# Altium project DaughterBoard Tester.PrjPcb
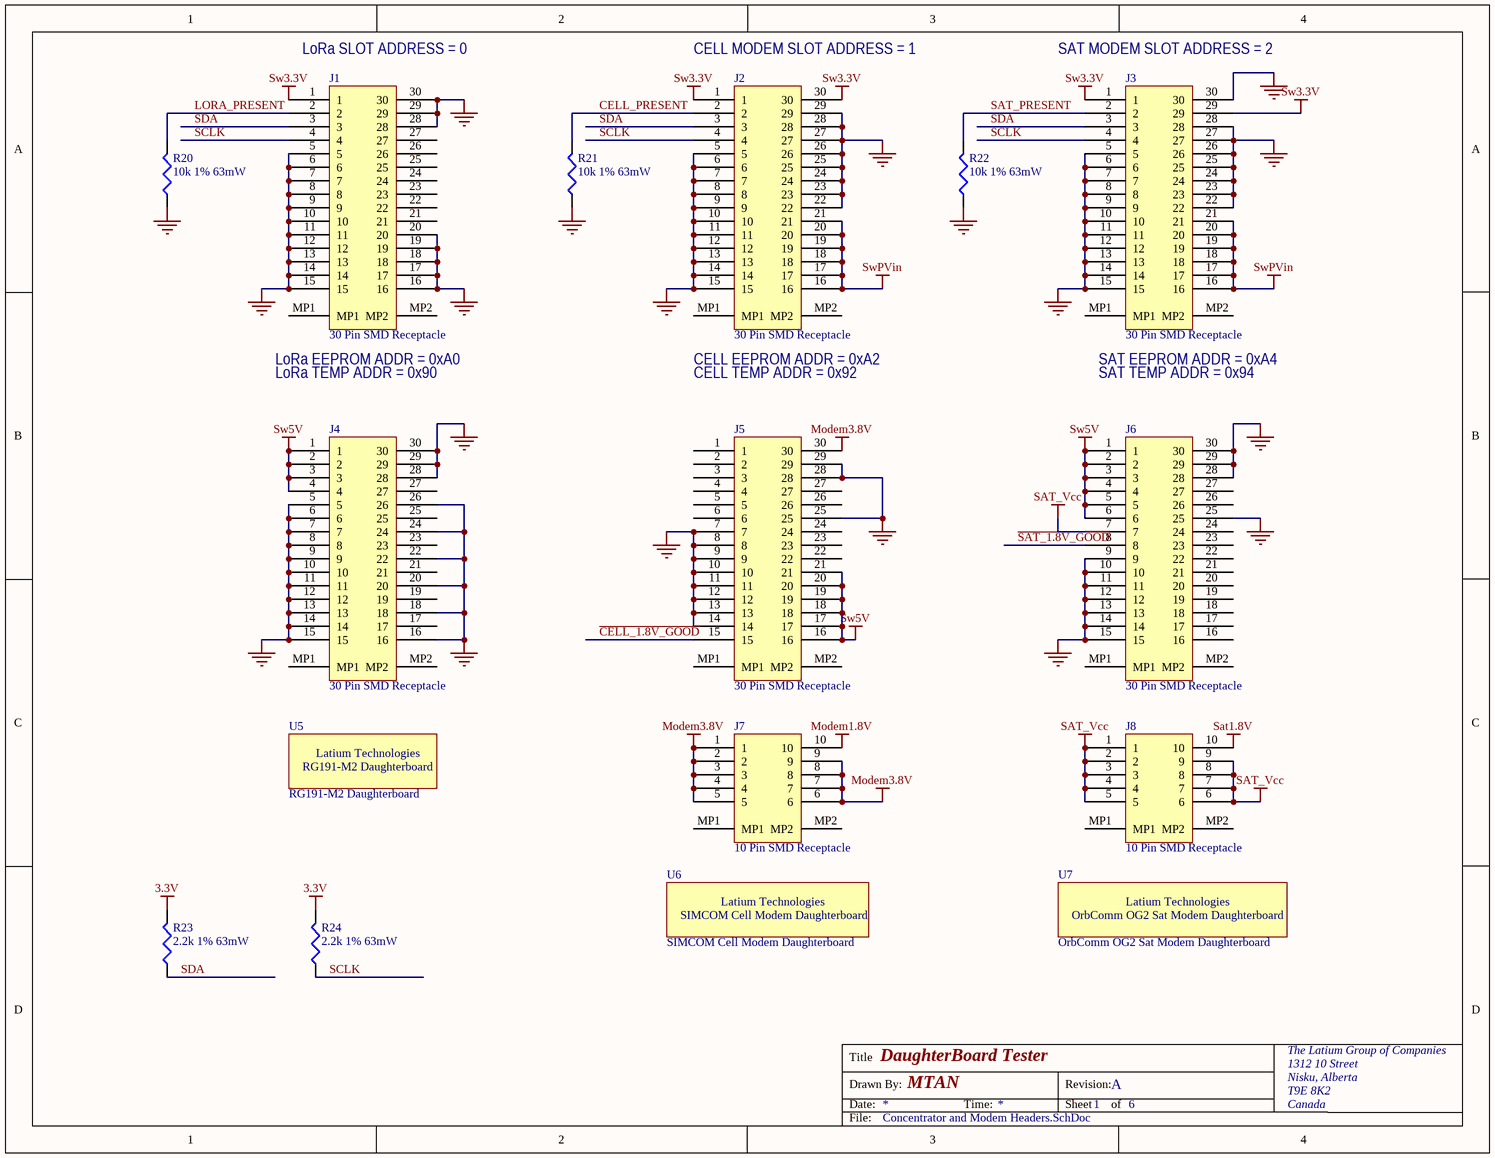
[diagram p0: Concentrator and Modem Headers.SchDoc]
6 sheets, 158 parts. Net scope: global (net labels, ports and power ports of the same name join across sheets).
Board file: DaughterBoard Tester.PcbDoc
Sheets:
  Concentrator and Modem Headers.SchDoc
  Expansion Headers.SchDoc
  USB.SchDoc
  Analog.SchDoc
  Power Supplies.SchDoc
  Loads.SchDoc

## Sheet Concentrator and Modem Headers.SchDoc: DaughterBoard Tester
size Letter; DrawnBy: MTAN; Organization: Altium Limited; DocumentNumber: 1; Revision: A; SheetNumber: 1; SheetTotal: 6

### Parts
J1  30 Pin SMD Receptacle  [10132798-031100LF]
J2  30 Pin SMD Receptacle  [10132798-031100LF]
J3  30 Pin SMD Receptacle  [10132798-031100LF]
J4  30 Pin SMD Receptacle  [10132798-031100LF]
J5  30 Pin SMD Receptacle  [10132798-031100LF]
J6  30 Pin SMD Receptacle  [10132798-031100LF]
J7  10 Pin SMD Receptacle  [10132798-011100LF]
J8  10 Pin SMD Receptacle  [10132798-011100LF]
R20  10k 1% 63mW  [RESC1005L]
R21  10k 1% 63mW  [RESC1005L]
R22  10k 1% 63mW  [RESC1005L]
R23  2.2k 1% 63mW  [RESC1005L]
R24  2.2k 1% 63mW  [RESC1005L]
U5  RG191-M2 Daughterboard  [RG191-M2 LoRa Daughterboard]  (no BOM)
U6  SIMCOM Cell Modem Daughterboard  [SIMCOM Cell Modem Daughterboard]  (no BOM)
U7  OrbComm OG2 Sat Modem Daughterboard  [OrbComm OG2 Daughterboard]  (no BOM)

### Nets
3.3V: R23.2 R24.2
GND: J1.5 J1.6 J1.7 J1.8 J1.9 J1.10 J1.11 J1.12 J1.13 J1.14 J1.15 J1.16 J1.17 J1.18 J1.19 J1.20 J1.28 J1.29 J1.30 J2.5 J2.6 J2.7 J2.8 J2.9 J2.10 J2.11 J2.12 J2.13 J2.14 J2.15 J2.22 J2.23 J2.24 J2.25 J2.26 J2.27 J2.28 J2.29 J3.5 J3.6 J3.7 J3.8 J3.9 J3.10 J3.11 J3.12 J3.13 J3.14 J3.15 J3.22 J3.23 J3.24 J3.25 J3.26 J3.27 J3.28 J3.30 J4.5 J4.6 J4.7 J4.8 J4.9 J4.10 J4.11 J4.12 J4.13 J4.14 J4.15 J4.16 J4.18 J4.20 J4.22 J4.24 J4.26 J4.28 J4.29 J4.30 J5.7 J5.8 J5.9 J5.10 J5.11 J5.12 J5.13 J5.14 J5.25 J5.28 J5.29 J6.9 J6.10 J6.11 J6.12 J6.13 J6.14 J6.15 J6.25 J6.28 J6.29 J6.30 R20.1 R21.1 R22.1
Modem1.8V: J7.10
Modem3.8V: J5.30 J7.1 J7.2 J7.3 J7.4 J7.5 J7.6 J7.7 J7.8 J7.9
Sat1.8V: J8.10
SAT_Vcc: J6.7 J8.1 J8.2 J8.3 J8.4 J8.5 J8.6 J8.7 J8.8 J8.9
Sw3.3V: J1.1 J2.1 J2.30 J3.1 J3.29
Sw5V: J4.1 J4.2 J4.3 J4.4 J5.16 J5.17 J5.18 J5.19 J5.20 J5.21 J6.1 J6.2 J6.3 J6.4 J6.5 J6.6
SwPVin: J2.16 J2.17 J2.18 J2.19 J2.20 J2.21 J3.16 J3.17 J3.18 J3.19 J3.20 J3.21
~{CELL_1.8V_GOOD}: J5.15
CELL_PRESENT: J2.2 R21.2
LORA_PRESENT: J1.2 R20.2
~{SAT_1.8V_GOOD}: J6.8
SAT_PRESENT: J3.2 R22.2
SCLK: J1.4 J2.4 J3.4 R24.1
SDA: J1.3 J2.3 J3.3 R23.1

Not connected (* = marked no-connect by the designer): J1 21 22 23 24 25 26 27 MP1 MP2; J2 MP1 MP2; J3 MP1 MP2; J4 17 19 21 23 25 27 MP1 MP2; J5 1 2 3 4 5 6 22 23 24 26 27 MP1 MP2; J6 16 17 18 19 20 21 22 23 24 26 27 MP1 MP2; J7 MP1 MP2; J8 MP1 MP2

### Notes on the sheet
- (near J1) LoRa SLOT ADDRESS = 0
- (near J2) CELL MODEM SLOT ADDRESS = 1
- (near J3) SAT MODEM SLOT ADDRESS = 2
- (near J1) LoRa EEPROM ADDR = 0xA0
- (near J2) CELL EEPROM ADDR = 0xA2
- (near J3) SAT EEPROM ADDR = 0xA4
- LoRa TEMP ADDR = 0x90
- CELL TEMP ADDR = 0x92
- SAT TEMP ADDR = 0x94
- Title
- Drawn By:
- Date:
- Time:
- Revision:
- Sheet
- of
- The Latium Group of Companies
- 1312 10 Street
- Nisku, Alberta
- T9E 8K2
- Canada
- File:
- (in symbol OrbComm OG2 Sat Modem Daughterboard) Latium Technologies
- (in symbol RG191-M2 Daughterboard) Latium Technologies
- (in symbol SIMCOM Cell Modem Daughterboard) Latium Technologies

### Library data of the parts
J1-J6 = Amphenol 30 Pos BergStak Plug: CONN RCPT 30POS SMD GOLD; Manufacturer: Amphenol ICC (FCI); Note: Mates with 10132797-031100LF plug 3mm between board height; Value: 30 Pin SMD Receptacle; Manufacturer Part Number: 10132798-031100LF; Supplier 1: Digi-Key; Supplier 1 Part Number: 609-5030-1-ND
J7 J8 = Amphenol 10 Pos BergStak Plug: CONN RCPT 10POS SMD GOLD; Manufacturer: Amphenol ICC (FCI); Note: Mates with 10132797-011100LF plug 3mm between board height; Value: 10 Pin SMD Receptacle; Manufacturer Part Number: 10132798-011100LF; Supplier 1: Digi-Key; Supplier 1 Part Number: 609-5026-1-ND
R20-R24 = Res3: Resistor
  R20-R22: Value: 10k 1% 63mW
  R23 R24: Value: 2.2k 1% 63mW
U5 = RG191-M2 Daughterboard: Value: RG191-M2 Daughterboard
U6 = SIMCOM Cell Modem Daughterboard: Value: SIMCOM Cell Modem Daughterboard
U7 = OrbComm OG2 Sat Modem Daughterboard: Value: OrbComm OG2 Sat Modem Daughterboard

## Sheet Expansion Headers.SchDoc: DaughterBoard Tester
size Letter; DrawnBy: MTAN; Organization: Altium Limited; DocumentNumber: 2; Revision: A; SheetNumber: 2; SheetTotal: 6
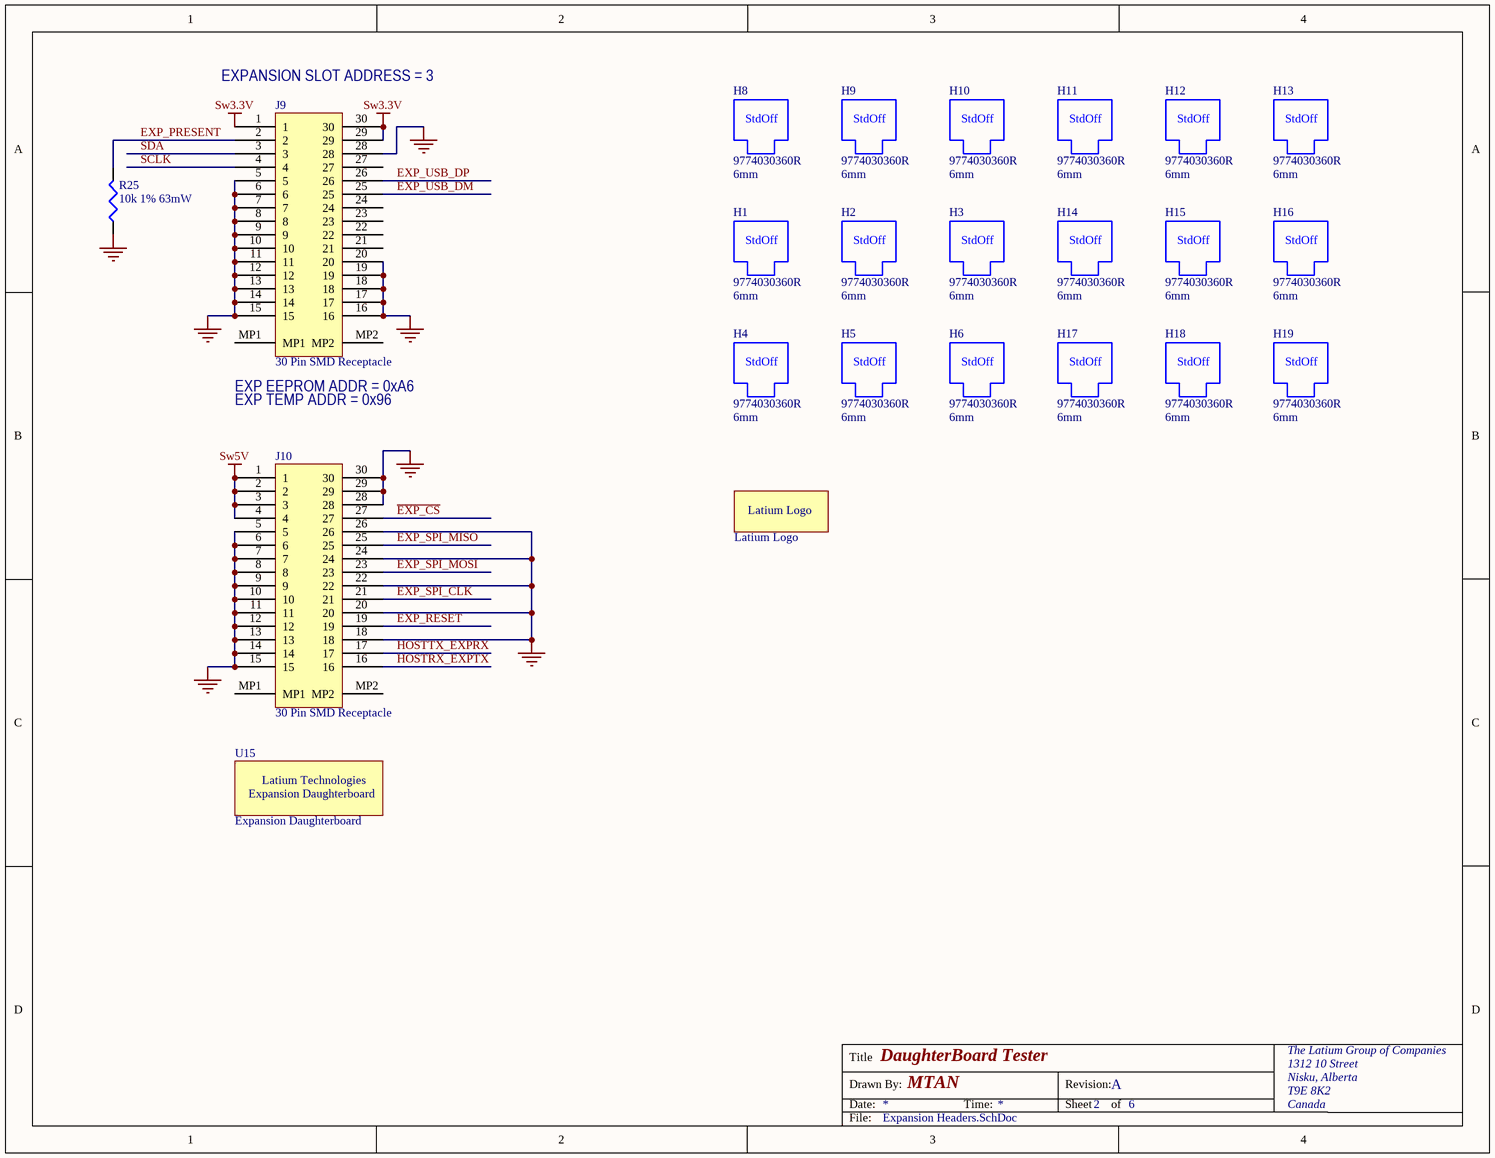
[diagram p1: Expansion Headers.SchDoc]

### Parts
H1  9774030360R  Height: 6mm  [Wurth 9774060360R]
H2  9774030360R  Height: 6mm  [Wurth 9774060360R]
H3  9774030360R  Height: 6mm  [Wurth 9774060360R]
H4  9774030360R  Height: 6mm  [Wurth 9774060360R]
H5  9774030360R  Height: 6mm  [Wurth 9774060360R]
H6  9774030360R  Height: 6mm  [Wurth 9774060360R]
H7  Latium Logo  [LatiumLogo]  (no BOM)
H8  9774030360R  Height: 6mm  [Wurth 9774060360R]
H9  9774030360R  Height: 6mm  [Wurth 9774060360R]
H10  9774030360R  Height: 6mm  [Wurth 9774060360R]
H11  9774030360R  Height: 6mm  [Wurth 9774060360R]
H12  9774030360R  Height: 6mm  [Wurth 9774060360R]
H13  9774030360R  Height: 6mm  [Wurth 9774060360R]
H14  9774030360R  Height: 6mm  [Wurth 9774060360R]
H15  9774030360R  Height: 6mm  [Wurth 9774060360R]
H16  9774030360R  Height: 6mm  [Wurth 9774060360R]
H17  9774030360R  Height: 6mm  [Wurth 9774060360R]
H18  9774030360R  Height: 6mm  [Wurth 9774060360R]
H19  9774030360R  Height: 6mm  [Wurth 9774060360R]
J9  30 Pin SMD Receptacle  [10132798-031100LF]
J10  30 Pin SMD Receptacle  [10132798-031100LF]
R25  10k 1% 63mW  [RESC1005L]
U15  Expansion Daughterboard  [Expansion Daughterboard]  (no BOM)

### Nets
GND: J9.5 J9.6 J9.7 J9.8 J9.9 J9.10 J9.11 J9.12 J9.13 J9.14 J9.15 J9.16 J9.17 J9.18 J9.19 J9.20 J9.28 J10.5 J10.6 J10.7 J10.8 J10.9 J10.10 J10.11 J10.12 J10.13 J10.14 J10.15 J10.18 J10.20 J10.22 J10.24 J10.26 J10.28 J10.29 J10.30 R25.1
Sw3.3V: J9.1 J9.29 J9.30
Sw5V: J10.1 J10.2 J10.3 J10.4
~{EXP_CS}: J10.27
EXP_PRESENT: J9.2 R25.2
EXP_RESET: J10.19
EXP_SPI_CLK: J10.21
EXP_SPI_MISO: J10.25
EXP_SPI_MOSI: J10.23
EXP_USB_DM: J9.25
EXP_USB_DP: J9.26
HOSTRX_EXPTX: J10.16
HOSTTX_EXPRX: J10.17
SCLK: J9.4
SDA: J9.3

Not connected (* = marked no-connect by the designer): J9 21 22 23 24 27 MP1 MP2; J10 MP1 MP2

### Notes on the sheet
- (near J9) EXPANSION SLOT ADDRESS = 3
- (near J9) EXP EEPROM ADDR = 0xA6
- EXP TEMP ADDR = 0x96
- Title
- Drawn By:
- Date:
- Time:
- Revision:
- Sheet
- of
- The Latium Group of Companies
- 1312 10 Street
- Nisku, Alberta
- T9E 8K2
- Canada
- File:
- (in symbol Expansion Daughterboard) Latium Technologies
- (in symbol SMD M3 Spacer) StdOff

### Library data of the parts
H1-H6 H8-H19 = SMD M3 Spacer: ROUND STANDOFF M3X0.5 STEEL 6MM; Manufacturer: Wurth Electronics Inc; Manufacturer Part Number: 9774060360R; Supplier 1: Digi-Key; Value: 9774030360R; ComponentLink1Description: Drawing; ComponentLink1URL: S:\Hardware\Data Sheets\Passive\Spacers\Wurth 9774060360R.pdf; Supplier 1 Part Number: 732-5273-1-ND
J9 J10 = Amphenol 30 Pos BergStak Plug: as J1 on sheet Concentrator and Modem Headers; Value: 30 Pin SMD Receptacle; Manufacturer Part Number: 10132798-031100LF; Supplier 1: Digi-Key; Supplier 1 Part Number: 609-5030-1-ND
R25 = Res3: Resistor; Value: 10k 1% 63mW
H7 = Latium Logo: Value: Latium Logo
U15 = Expansion Daughterboard: Value: Expansion Daughterboard

## Sheet USB.SchDoc: DaughterBoard Tester
size Letter; DrawnBy: MTAN; Organization: Altium Limited; DocumentNumber: 3; Revision: A; SheetNumber: 3; SheetTotal: 6
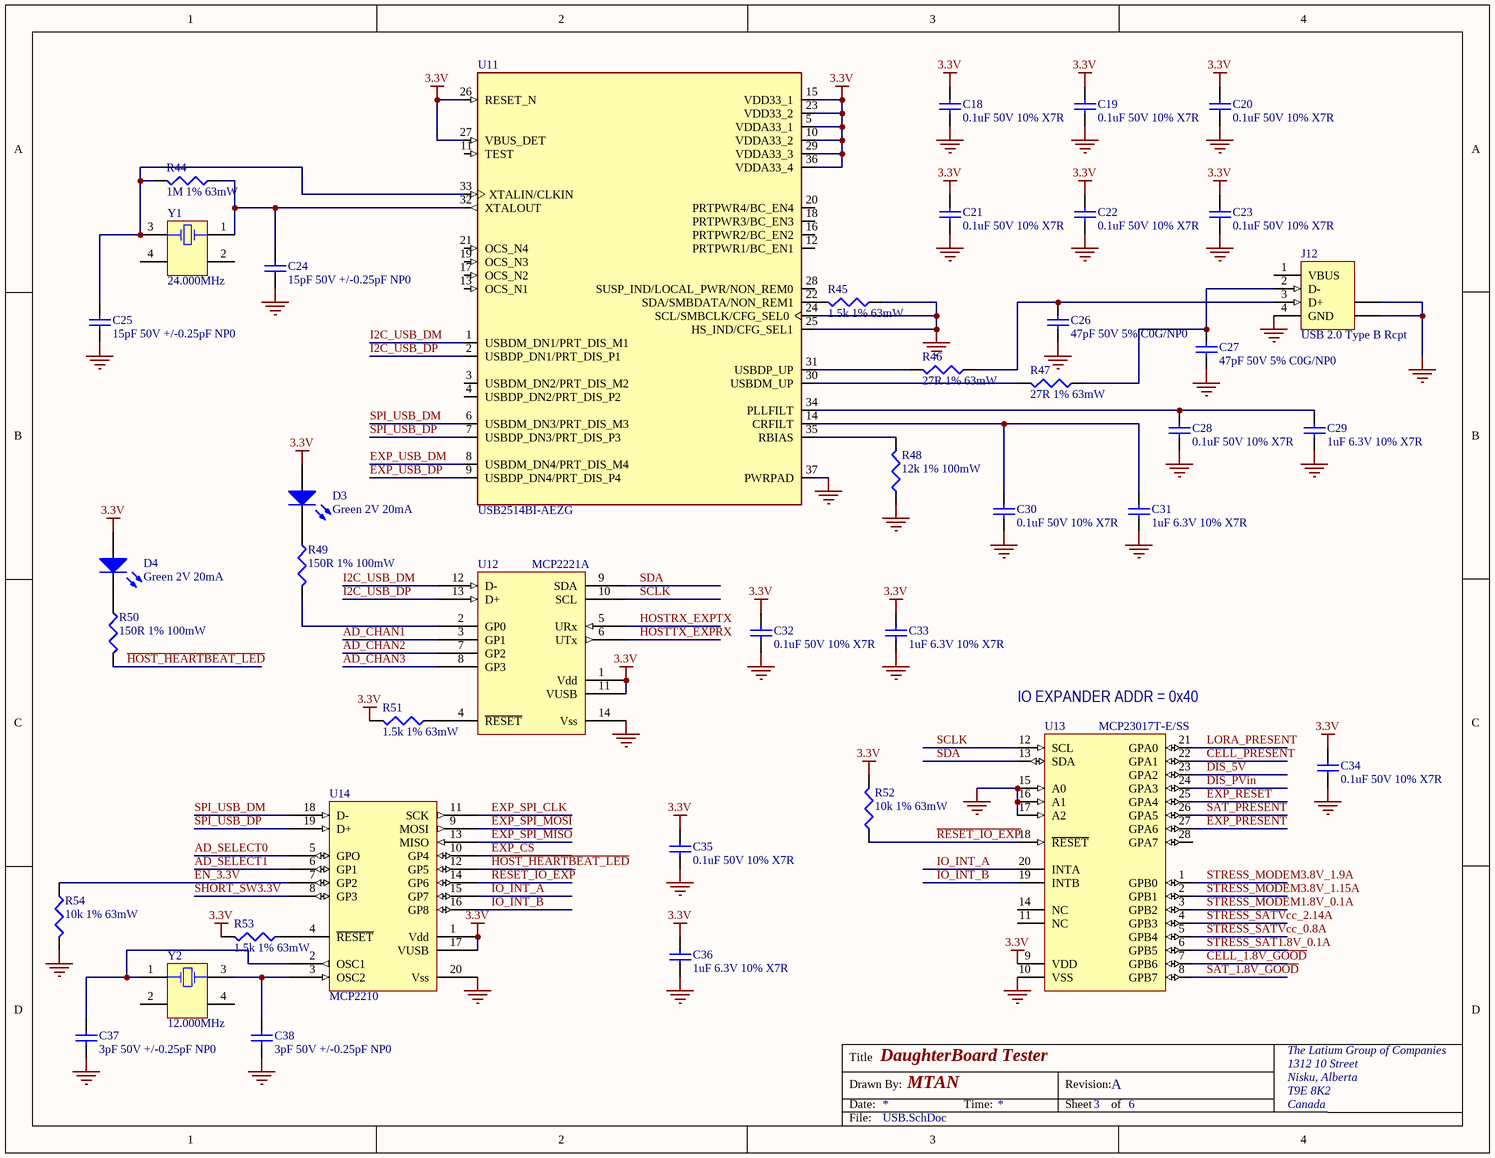
[diagram p2: USB.SchDoc]

### Parts
C18  0.1uF 50V 10% X7R  [CAPC1005L]
C19  0.1uF 50V 10% X7R  [CAPC1005L]
C20  0.1uF 50V 10% X7R  [CAPC1005L]
C21  0.1uF 50V 10% X7R  [CAPC1005L]
C22  0.1uF 50V 10% X7R  [CAPC1005L]
C23  0.1uF 50V 10% X7R  [CAPC1005L]
C24  15pF 50V +/-0.25pF NP0  [CAPC1005L]
C25  15pF 50V +/-0.25pF NP0  [CAPC1005L]
C26  47pF 50V 5% C0G/NP0  [CAPC1005L]
C27  47pF 50V 5% C0G/NP0  [CAPC1005L]
C28  0.1uF 50V 10% X7R  [CAPC1005L]
C29  1uF 6.3V 10% X7R  [CAPC1005L]
C30  0.1uF 50V 10% X7R  [CAPC1005L]
C31  1uF 6.3V 10% X7R  [CAPC1005L]
C32  0.1uF 50V 10% X7R  [CAPC1005L]
C33  1uF 6.3V 10% X7R  [CAPC1005L]
C34  0.1uF 50V 10% X7R  [CAPC1005L]
C35  0.1uF 50V 10% X7R  [CAPC1005L]
C36  1uF 6.3V 10% X7R  [CAPC1005L]
C37  3pF 50V +/-0.25pF NP0  [CAPC1005L]
C38  3pF 50V +/-0.25pF NP0  [CAPC1005L]
D3  Green 2V 20mA  [CD1608-0603]
D4  Green 2V 20mA  [CD1608-0603]
J12  USB 2.0 Type B Rcpt  [1-1734346-1]
R44  1M 1% 63mW  [RESC1005L]
R45  1.5k 1% 63mW  [RESC1005L]
R46  27R 1% 63mW  [RESC1005L]
R47  27R 1% 63mW  [RESC1005L]
R48  12k 1% 100mW  [J1-0603]
R49  150R 1% 100mW  [RESC1608L]
R50  150R 1% 100mW  [RESC1608L]
R51  1.5k 1% 63mW  [RESC1005L]
R52  10k 1% 63mW  [RESC1005L]
R53  1.5k 1% 63mW  [RESC1005L]
R54  10k 1% 63mW  [RESC1005L]
U11  USB2514BI-AEZG  [QFN50P600X600X100-37N]
U12  MCP2221A  [TSSOP14_L]
U13  MCP23017T-E/SS  [SSOP-SS28_L]
U14  MCP2210  [SSOP20_L]
Y1  24.000MHz  [CFPX-5]
Y2  12.000MHz  [CFPX-5]

### Nets
3.3V: C18.1 C19.1 C20.1 C21.1 C22.1 C23.1 C32.1 C33.1 C34.1 C35.1 C36.1 D3.1(A) D4.1(A) R51.2 R52.2 R53.2 U11.5(VDDA33_1) U11.10(VDDA33_2) U11.15(VDD33_1) U11.23(VDD33_2) U11.26(RESET_N) U11.27(VBUS_DET) U11.29(VDDA33_3) U11.36(VDDA33_4) U12.1(Vdd) U12.11(VUSB) U13.9(VDD) U14.1(Vdd) U14.17(VUSB)
GND: C18.2 C19.2 C20.2 C21.2 C22.2 C23.2 C24.2 C25.2 C26.2 C27.2 C28.2 C29.2 C30.2 C31.2 C32.2 C33.2 C34.2 C35.2 C36.2 C37.2 C38.2 J12.4(GND) J12.MP1(SHLD) J12.MP2(SHLD) R45.1 R48.1 R54.2 U11.24(SCL/SMBCLK/CFG_SEL0) U11.25(HS_IND/CFG_SEL1) U11.37(PWRPAD) U12.14(Vss) U13.10(VSS) U13.15(A0) U13.16(A1) U13.17(A2) U14.20(Vss)
AD_CHAN1: U12.3(GP1)
AD_CHAN2: U12.7(GP2)
AD_CHAN3: U12.8(GP3)
AD_SELECT0: U14.5(GPO)
AD_SELECT1: U14.6(GP1)
~{CELL_1.8V_GOOD}: U13.7(GPB6)
CELL_PRESENT: U13.22(GPA1)
DIS_5V: U13.23(GPA2)
DIS_PVin: U13.24(GPA3)
~{EXP_CS}: U14.10(GP4)
EN_3.3V: R54.1 U14.7(GP2)
EXP_PRESENT: U13.27(GPA6)
EXP_RESET: U13.25(GPA4)
EXP_SPI_CLK: U14.11(SCK)
EXP_SPI_MISO: U14.13(MISO)
EXP_SPI_MOSI: U14.9(MOSI)
EXP_USB_DM: U11.8(USBDM_DN4/PRT_DIS_M4)
EXP_USB_DP: U11.9(USBDP_DN4/PRT_DIS_P4)
~{HOST_HEARTBEAT_LED}: R50.2 U14.12(GP5)
HOSTRX_EXPTX: U12.5(URx)
HOSTTX_EXPRX: U12.6(UTx)
I2C_USB_DM: U11.1(USBDM_DN1/PRT_DIS_M1) U12.12(D-)
I2C_USB_DP: U11.2(USBDP_DN1/PRT_DIS_P1) U12.13(D+)
IO_INT_A: U13.20(INTA) U14.15(GP7)
IO_INT_B: U13.19(INTB) U14.16(GP8)
LORA_PRESENT: U13.21(GPA0)
~{RESET_IO_EXP}: R52.1 U13.18(~{RESET}) U14.14(GP6)
~{SAT_1.8V_GOOD}: U13.8(GPB7)
~{SHORT_SW3.3V}: U14.8(GP3)
SAT_PRESENT: U13.26(GPA5)
SCLK: U12.10(SCL) U13.12(SCL)
SDA: U12.9(SDA) U13.13(SDA)
SPI_USB_DM: U11.6(USBDM_DN3/PRT_DIS_M3) U14.18(D-)
SPI_USB_DP: U11.7(USBDP_DN3/PRT_DIS_P3) U14.19(D+)
STRESS_MODEM1.8V_0.1A: U13.3(GPB2)
STRESS_MODEM3.8V_1.9A: U13.1(GPB0)
STRESS_MODEM3.8V_1.15A: U13.2(GPB1)
STRESS_SAT1.8V_0.1A: U13.6(GPB5)
STRESS_SATVcc_0.8A: U13.5(GPB4)
STRESS_SATVcc_2.14A: U13.4(GPB3)
NetC24_1: C24.1 R44.1 U11.32(XTALOUT) Y1.1(OSC1)
NetC25_1: C25.1 R44.2 U11.33(XTALIN/CLKIN) Y1.3(OSC2)
NetC26_1: C26.1 J12.3(D+) R46.1
NetC27_1: C27.1 J12.2(D-) R47.1
NetC28_1: C28.1 C29.1 U11.34(PLLFILT)
NetC30_1: C30.1 C31.1 U11.14(CRFILT)
NetC37_1: C37.1 U14.2(OSC1) Y2.1(OSC1)
NetC38_1: C38.1 U14.3(OSC2) Y2.3(OSC2)
NetD3_2: D3.2(K) R49.1
NetD4_2: D4.2(K) R50.1
NetR45_2: R45.2 U11.22(SDA/SMBDATA/NON_REM1)
NetR46_2: R46.2 U11.31(USBDP_UP)
NetR47_2: R47.2 U11.30(USBDM_UP)
NetR48_2: R48.2 U11.35(RBIAS)
NetR49_2: R49.2 U12.2(GP0)
NetR51_1: R51.1 U12.4(~{RESET})
NetR53_1: R53.1 U14.4(~{RESET})

Not connected (* = marked no-connect by the designer): J12 1(VBUS); U11 3(USBDM_DN2/PRT_DIS_M2) 4(USBDP_DN2/PRT_DIS_P2) 11(TEST) 12(PRTPWR1/BC_EN1) 13(OCS_N1) 16(PRTPWR2/BC_EN2) 17(OCS_N2) 18(PRTPWR3/BC_EN3) 19(OCS_N3) 20(PRTPWR4/BC_EN4) 21(OCS_N4) 28(SUSP_IND/LOCAL_PWR/NON_REM0); U13 11(NC) 14(NC) 28(GPA7); Y1 2(NC) 4(NC); Y2 2(NC) 4(NC)

### Notes on the sheet
- (near U13) IO EXPANDER ADDR = 0x40
- Title
- Drawn By:
- Date:
- Time:
- Revision:
- Sheet
- of
- The Latium Group of Companies
- 1312 10 Street
- Nisku, Alberta
- T9E 8K2
- Canada
- File:

### Library data of the parts
C18-C38 = Cap: Capacitor
  C18-C23 C28 C30 C32 C34 C35: Value: 0.1uF 50V 10% X7R
  C24 C25: Value: 15pF 50V +/-0.25pF NP0
  C26 C27: Value: 47pF 50V 5% C0G/NP0
  C29 C31 C33 C36: Value: 1uF 6.3V 10% X7R
  C37 C38: Value: 3pF 50V +/-0.25pF NP0
D3 D4 = LED2: LED GREEN CLEAR 0603 SMD; Manufacturer: Wurth Electronics Inc; Manufacturer Part Number: 150060VS75000; Value: Green 2V 20mA; Supplier 1: Digi-Key; Supplier 1 Part Number: 732-4980-1-ND
J12 = 1-1470156-1: CONN RCPT USB2.0 TYPEB 4P SMD RA; Manufacturer: TE Connectivity AMP Connectors; Value: USB 2.0 Type B Rcpt; Manufacturer Part Number: 1-1734346-1; Supplier 1: Digi-Key; Supplier 1 Part Number: A110862CT-ND
R44-R54 = Res3: Resistor
  R44: Value: 1M 1% 63mW
  R45 R51 R53: Value: 1.5k 1% 63mW
  R46 R47: Value: 27R 1% 63mW
  R48: Value: 12k 1% 100mW
  R49 R50: Value: 150R 1% 100mW
  R52 R54: Value: 10k 1% 63mW
U11 = USB2514BI-AEZG: IC CONTROLLER USB 36QFN; Manufacturer: Microchip Technology; Value: USB2514BI-AEZG-TR; Manufacturer Part Number: USB2514BI-AEZG-TR; Supplier 1: Digi-Key; Supplier 1 Part Number: USB2514BI-AEZG-CT-ND
U12 = MCP2221A: IC USB TO I2C/UART 14TSSOP; Manufacturer: Microchip Technology; Manufacturer Part Number: MCP2221AT-I/ST; Value: MCP2221A; Supplier 1: Digi-Key; Supplier 1 Part Number: MCP2221AT-I/STCT-ND
U13 = MCP23017-E/SS: IC I/O EXPANDER 16BIT I2C 28SSOP; Manufacturer: Microchip Technology; Value: MCP23017T-E/SS; Manufacturer Part Number: MCP23017T-E/SS; Supplier 1: Digi-Key; Supplier 1 Part Number: MCP23017T-E/SSCT-ND
U14 = MCP2210: IC CONVERTER USB-SPI 20-SSOP; Manufacturer: Microchip Technology; Manufacturer Part Number: MCP2210T-I/SS; Value: MCP2210; Supplier 1: Digi-Key; Supplier 1 Part Number: MCP2210T-I/SSCT-ND
Y1 = CFPX-5: CRYSTAL 24.0000MHZ 18PF SMD; Manufacturer Part Number: TSX-3225 24.0000MF18X-C0; Manufacturer: Epson; Value: 24.000MHz; Supplier 1: Digi-Key; Supplier 1 Part Number: SER4210CT-ND
Y2 = CFPX-5: CRYSTAL 12.0000MHZ 8PF SMD; Manufacturer Part Number: NX3225SA-12.000M-STD-CRS-2; Manufacturer: NDK America Inc; ComponentLink1Description: Data Sheet; ComponentLink1URL: S:\Hardware\Data Sheets\Passive\Crystals\c_NX3225SA-STD-CRS-2_e.pdf; Value: 12.000MHz; Supplier 1: Digi-Key; Supplier 1 Part Number: 644-1128-1-ND

## Sheet Analog.SchDoc: DaughterBoard Tester
size Letter; DrawnBy: MTAN; Organization: Altium Limited; DocumentNumber: 4; Revision: A; SheetNumber: 4; SheetTotal: 6
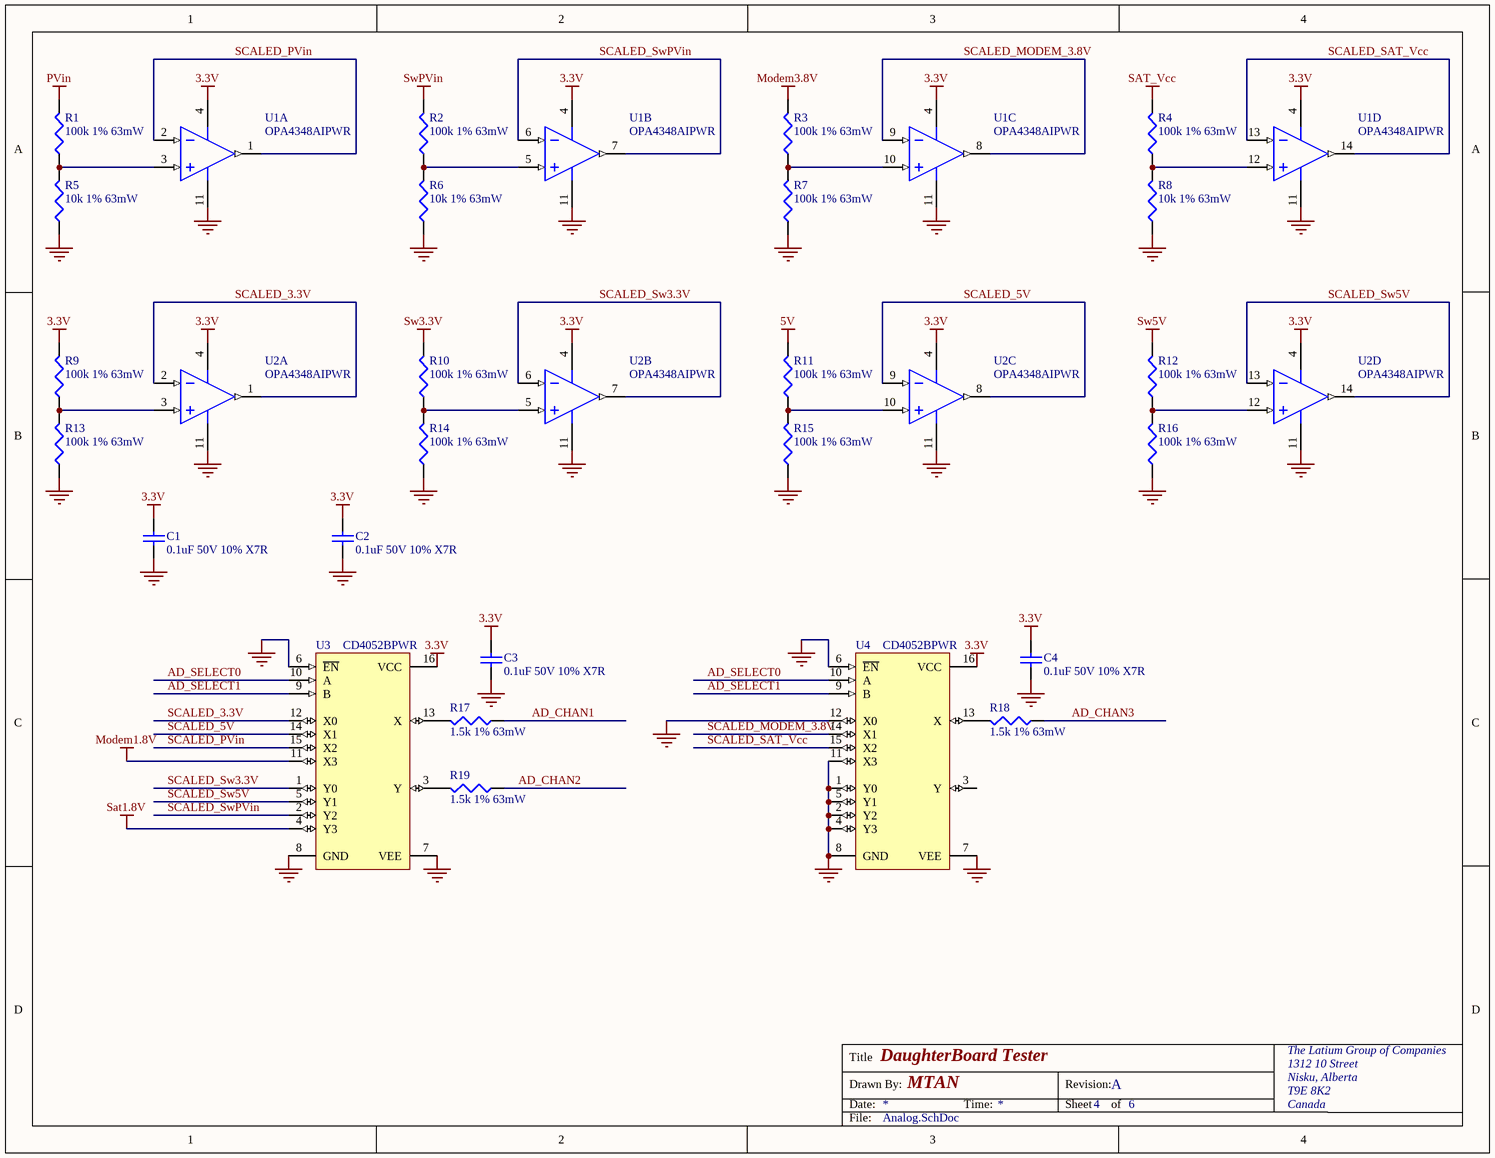
[diagram p3: Analog.SchDoc]

### Parts
C1  0.1uF 50V 10% X7R  [CAPC1005L]
C2  0.1uF 50V 10% X7R  [CAPC1005L]
C3  0.1uF 50V 10% X7R  [CAPC1005L]
C4  0.1uF 50V 10% X7R  [CAPC1005L]
R1  100k 1% 63mW  [RESC1005L]
R2  100k 1% 63mW  [RESC1005L]
R3  100k 1% 63mW  [RESC1005L]
R4  100k 1% 63mW  [RESC1005L]
R5  10k 1% 63mW  [RESC1005L]
R6  10k 1% 63mW  [RESC1005L]
R7  100k 1% 63mW  [RESC1005L]
R8  10k 1% 63mW  [RESC1005L]
R9  100k 1% 63mW  [RESC1005L]
R10  100k 1% 63mW  [RESC1005L]
R11  100k 1% 63mW  [RESC1005L]
R12  100k 1% 63mW  [RESC1005L]
R13  100k 1% 63mW  [RESC1005L]
R14  100k 1% 63mW  [RESC1005L]
R15  100k 1% 63mW  [RESC1005L]
R16  100k 1% 63mW  [RESC1005L]
R17  1.5k 1% 63mW  [RESC1005L]
R18  1.5k 1% 63mW  [RESC1005L]
R19  1.5k 1% 63mW  [RESC1005L]
U1  OPA4348AIPWR  [TI-PW14_L]  (parts A,B,C,D of 4)
U2  OPA4348AIPWR  [TI-PW14_L]  (parts A,B,C,D of 4)
U3  CD4052BPWR  [TSSOP-16_L]
U4  CD4052BPWR  [TSSOP-16_L]

### Nets
3.3V: C1.1 C2.1 C3.1 C4.1 R9.2 U1.4(V+) U2.4(V+) U3.16(VCC) U4.16(VCC)
5V: R11.2
GND: C1.2 C2.2 C3.2 C4.2 R5.1 R6.1 R7.1 R8.1 R13.1 R14.1 R15.1 R16.1 U1.11(V-) U2.11(V-) U3.6(~{EN}) U3.7(VEE) U3.8(GND) U4.1(Y0) U4.2(Y2) U4.4(Y3) U4.5(Y1) U4.6(~{EN}) U4.7(VEE) U4.8(GND) U4.11(X3) U4.12(X0)
Modem1.8V: U3.11(X3)
Modem3.8V: R3.2
PVin: R1.2
Sat1.8V: U3.4(Y3)
SAT_Vcc: R4.2
Sw3.3V: R10.2
Sw5V: R12.2
SwPVin: R2.2
AD_CHAN1: R17.1
AD_CHAN2: R19.1
AD_CHAN3: R18.1
AD_SELECT0: U3.10(A) U4.10(A)
AD_SELECT1: U3.9(B) U4.9(B)
SCALED_3.3V: U2.1(OUT_A) U2.2(IN_A-) U3.12(X0)
SCALED_5V: U2.8(OUT_C) U2.9(IN_C-) U3.14(X1)
SCALED_MODEM_3.8V: U1.8(OUT_C) U1.9(IN_C-) U4.14(X1)
SCALED_PVin: U1.1(OUT_A) U1.2(IN_A-) U3.15(X2)
SCALED_SAT_Vcc: U1.13(IN_D-) U1.14(OUT_D) U4.15(X2)
SCALED_Sw3.3V: U2.6(IN_B-) U2.7(OUT_B) U3.1(Y0)
SCALED_Sw5V: U2.13(IN_D-) U2.14(OUT_D) U3.5(Y1)
SCALED_SwPVin: U1.6(IN_B-) U1.7(OUT_B) U3.2(Y2)
NetR1_1: R1.1 R5.2 U1.3(IN_A+)
NetR2_1: R2.1 R6.2 U1.5(IN_B+)
NetR3_1: R3.1 R7.2 U1.10(IN_C+)
NetR4_1: R4.1 R8.2 U1.12(IN_D+)
NetR9_1: R9.1 R13.2 U2.3(IN_A+)
NetR10_1: R10.1 R14.2 U2.5(IN_B+)
NetR11_1: R11.1 R15.2 U2.10(IN_C+)
NetR12_1: R12.1 R16.2 U2.12(IN_D+)
NetR17_2: R17.2 U3.13(X)
NetR18_2: R18.2 U4.13(X)
NetR19_2: R19.2 U3.3(Y)

Not connected (* = marked no-connect by the designer): U4 3(Y)

### Notes on the sheet
- Title
- Drawn By:
- Date:
- Time:
- Revision:
- Sheet
- of
- The Latium Group of Companies
- 1312 10 Street
- Nisku, Alberta
- T9E 8K2
- Canada
- File:

### Library data of the parts
C1-C4 = Cap: Capacitor; Value: 0.1uF 50V 10% X7R
R1-R19 = Res3: Resistor
  R1-R4 R7 R9-R16: Value: 100k 1% 63mW
  R5 R6 R8: Value: 10k 1% 63mW
  R17-R19: Value: 1.5k 1% 63mW
U1 U2 = OPA4348AIPWR: IC OPAMP GP 4 CIRCUIT 14TSSOP; Manufacturer: Texas Instruments; Value: OPA4348AIPWR; Manufacturer Part Number: OPA4348AIPWR; Supplier 1: Digi-Key; Supplier 1 Part Number: 296-29283-1-ND
U3 U4 = CD4052BCM: IC MUX/DEMUX DUAL 4X1 16TSSOP; Manufacturer: Texas Instruments; Value: CD4052BPWR; Manufacturer Part Number: CD4052BPWR; Supplier 1: Digi-Key; Supplier 1 Part Number: 296-14273-1-ND

## Sheet Power Supplies.SchDoc: DaughterBoard Tester
size Letter; DrawnBy: MTAN; Organization: Altium Limited; DocumentNumber: 5; Revision: A; SheetNumber: 5; SheetTotal: 6
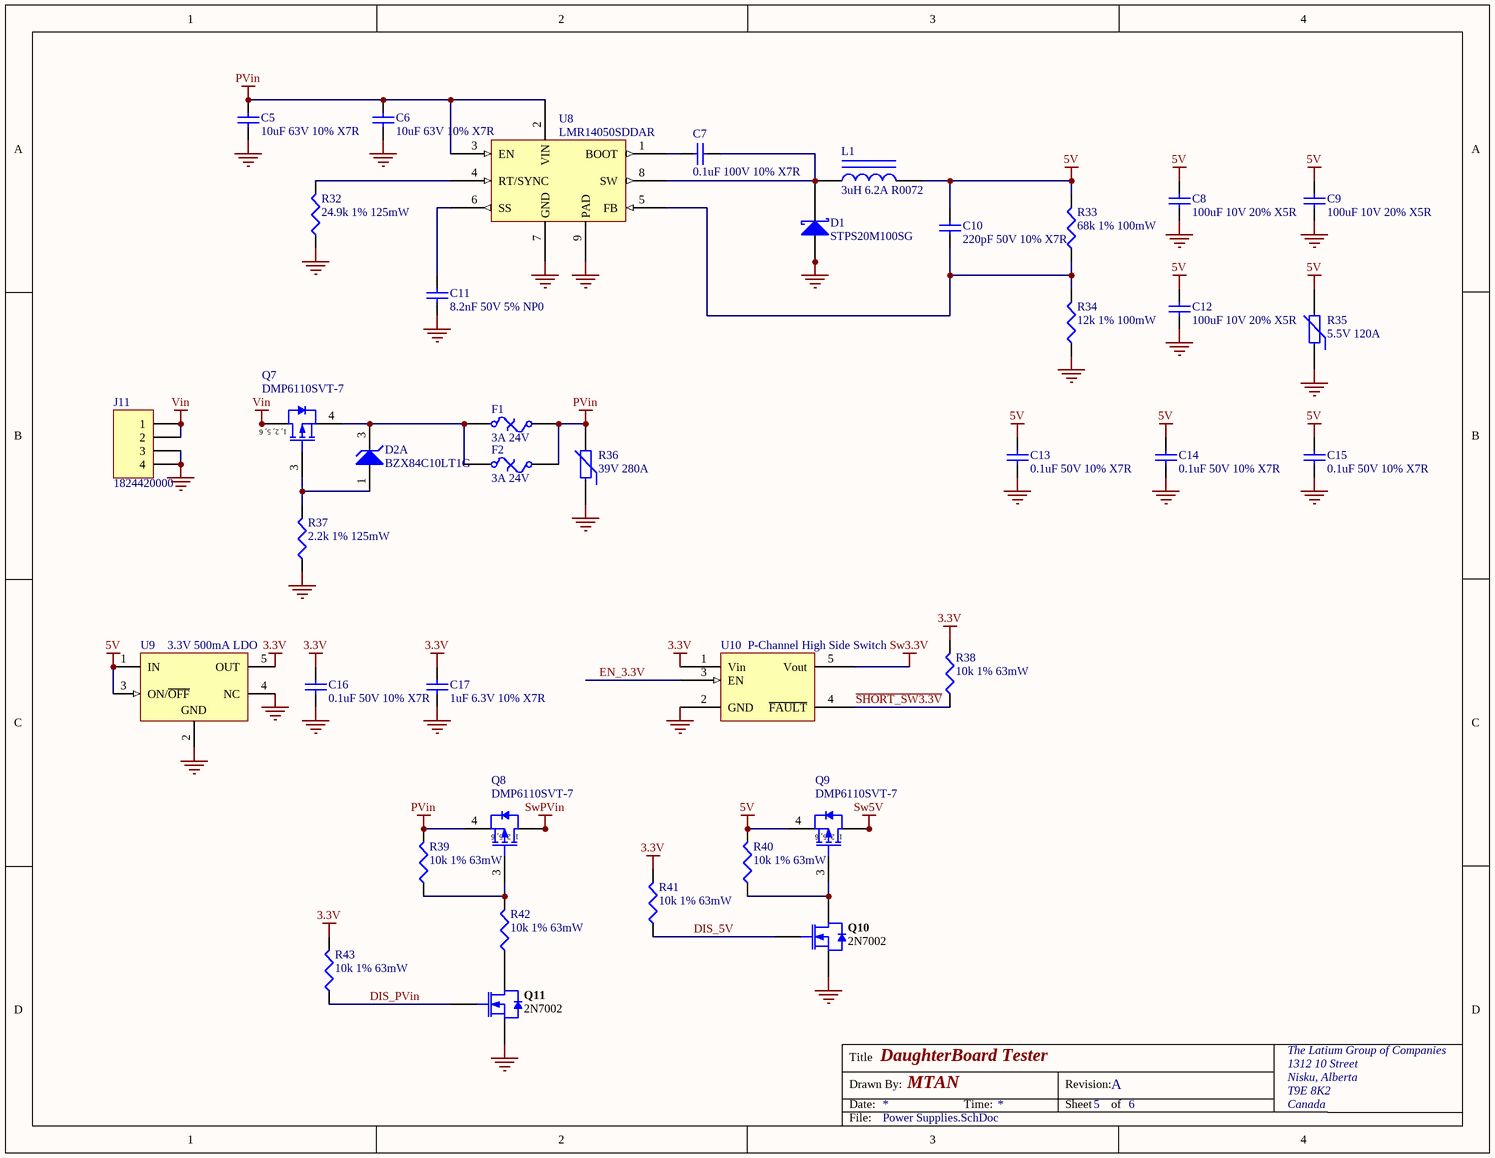
[diagram p4: Power Supplies.SchDoc]

### Parts
C5  10uF 63V 10% X7R  [C1210_L]
C6  10uF 63V 10% X7R  [C1210_L]
C7  0.1uF 100V 10% X7R  [C0805]
C8  100uF 10V 20% X5R  [C1210_L]
C9  100uF 10V 20% X5R  [C1210_L]
C10  220pF 50V 10% X7R  [1608[0603]]
C11  8.2nF 50V 5% NP0  [1608[0603]]
C12  100uF 10V 20% X5R  [C1210_L]
C13  0.1uF 50V 10% X7R  [CAPC1005L]
C14  0.1uF 50V 10% X7R  [CAPC1005L]
C15  0.1uF 50V 10% X7R  [CAPC1005L]
C16  0.1uF 50V 10% X7R  [CAPC1005L]
C17  1uF 6.3V 10% X7R  [CAPC1005L]
D1  STPS20M100SG  [ONSC-D2PAK-3-418AJ_A_V]
D2  BZX84C10LT1G  [SOT23-3_L]  (part A of 2)
F1  3A 24V  [2920]
F2  3A 24V  [2920]
J11  1824420000  [1824420000]
L1  3uH 6.2A R0072  [SRU1048]
Q7  DMP6110SVT-7  [SOT23-6_L]
Q8  DMP6110SVT-7  [SOT23-6_L]
Q9  DMP6110SVT-7  [SOT23-6_L]
Q10  2N7002  [INF-PG-SOT23_L]
Q11  2N7002  [INF-PG-SOT23_L]
R32  24.9k 1% 125mW  [6-0805_L]
R33  68k 1% 100mW  [J1-0603]
R34  12k 1% 100mW  [J1-0603]
R35  5.5V 120A  [6-0805_L]
R36  39V 280A  [RESC3225L]
R37  2.2k 1% 125mW  [6-0805_L]
R38  10k 1% 63mW  [RESC1005L]
R39  10k 1% 63mW  [RESC1005L]
R40  10k 1% 63mW  [RESC1005L]
R41  10k 1% 63mW  [RESC1005L]
R42  10k 1% 63mW  [RESC1005L]
R43  10k 1% 63mW  [RESC1005L]
U8  LMR14050SDDAR  [MRA08A_L]
U9  3.3V 500mA LDO  [MF05A_L]
U10  P-Channel High Side Switch  [SOT23-5_L]

### Nets
3.3V: C16.1 C17.1 R38.2 R41.2 R43.2 U9.5(OUT) U10.1(Vin)
5V: C8.2 C9.2 C10.2 C12.2 C13.1 C14.1 C15.1 L1.2 Q9.4(S) R33.2 R35.2 R40.2 U9.1(IN) U9.3(ON/~{OFF})
GND: C5.1 C6.1 C8.1 C9.1 C11.1 C12.1 C13.2 C14.2 C15.2 C16.2 C17.2 D1.1(A) D1.3(A) J11.3 J11.4 Q10.2(SOURCE) Q11.2(SOURCE) R32.1 R34.1 R35.1 R36.1 R37.1 U8.7(GND) U8.9(PAD) U9.2(GND) U9.4(NC) U10.2(GND)
PVin: C5.2 C6.2 F1.2 F2.2 Q8.4(S) R36.2 R39.2 U8.2(VIN) U8.3(EN)
Sw3.3V: U10.5(Vout)
Sw5V: Q9.1(D) Q9.2(D) Q9.5(D) Q9.6(D)
SwPVin: Q8.1(D) Q8.2(D) Q8.5(D) Q8.6(D)
Vin: J11.1 J11.2 Q7.1(D) Q7.2(D) Q7.5(D) Q7.6(D)
DIS_5V: Q10.1(GATE) R41.1
DIS_PVin: Q11.1(GATE) R43.1
EN_3.3V: U10.3(EN)
~{SHORT_SW3.3V}: R38.1 U10.4(~{FAULT})
NetC7_1: C7.1 D1.4(K) L1.1 U8.8(SW)
NetC7_2: C7.2 U8.1(BOOT)
NetC10_1: C10.1 R33.1 R34.2 U8.5(FB)
NetC11_2: C11.2 U8.6(SS)
NetD2_1: D2.1(A) Q7.3(G) R37.2
NetD2_3: D2.3(K) F1.1 F2.1 Q7.4(S)
NetQ8_3: Q8.3(G) R39.1 R42.2
NetQ9_3: Q9.3(G) Q10.3(DRAIN) R40.1
NetQ11_3: Q11.3(DRAIN) R42.1
NetR32_2: R32.2 U8.4(RT/SYNC)

### Notes on the sheet
- Title
- Drawn By:
- Date:
- Time:
- Revision:
- Sheet
- of
- The Latium Group of Companies
- 1312 10 Street
- Nisku, Alberta
- T9E 8K2
- Canada
- File:
- (in symbol NTGS3136PT1G) 1, 2, 5, 6

### Library data of the parts
C5-C17 = Cap: Capacitor
  C5 C6: Value: 10uF 63V 10% X7R
  C7: Value: 0.1uF 100V 10% X7R
  C8 C9 C12: Value: 100uF 10V 20% X5R
  C10: Value: 220pF 50V 10% X7R
  C11: Value: 8.2nF 50V 5% NP0
  C13-C16: Value: 0.1uF 50V 10% X7R
  C17: Value: 1uF 6.3V 10% X7R
D1 = BAS70: DIODE SCHOTTKY 100V 20A D2PAK; Manufacturer: STMicroelectronics; ComponentLink2Description: Datasheet; ComponentLink2URL: S:\Hardware\Data Sheets\Passive\Diodes\STPS20M100.pdf; Value: STPS20M100SG; Manufacturer Part Number: STPS20M100SG; Supplier 1: Digi-Key; Supplier 1 Part Number: 497-10993-1-ND
D2 = BZX84C10LT1G: DIODE ZENER 10V 225MW SOT23-3; Manufacturer: On Semiconductor; Supplier 1: Digi-Key; Supplier 1 Part Number: BZX84C10LT1GOSCT-ND; ComponentLink1Description: Data Sheet; ComponentLink1URL: S:\Hardware\Data Sheets\Passive\Diodes\BZX84C2V4LT1-D.pdf; Value: BZX84C10LT1G; Manufacturer Part Number: BZX84C10LT1G
F1 F2 = Fuse Thermal: Thermal Fuse; Manufacturer Part Number: SMDC300F/24-2; Manufacturer: Littelfuse Inc; Value: 3A 24V; Supplier 1: Digi-Key; Supplier 1 Part Number: SMDC300F/24-2CT-ND
J11 = Header 4H: TERM BLK 2POS SIDE ENT 3.5MM PCB; Manufacturer: Weidmuller; Value: 1824420000; Manufacturer Part Number: 1824420000; Supplier 1: Digi-Key; Supplier 1 Part Number: 281-2020-ND
L1 = Inductor Iron: FIXED IND 3UH 6.2A 7.2 MOHM SMD; Manufacturer Part Number: SRU1048-3R0Y; Manufacturer: Bourns Inc; Value: 3uH 6.2A R0072; Supplier 1: Digi-Key; Supplier 1 Part Number: SRU1048-3R0YCT-ND; ComponentLink1Description: Data Sheet; ComponentLink1URL: S:\Hardware\Data Sheets\Passive\Inductors\SRU1048.pdf
Q7-Q9 = NTGS3136PT1G: MOSFET P-CH 60V TSOT26; Manufacturer: Diodes Incorporated; ComponentLink1Description: Data Sheet; ComponentLink1URL: S:\Hardware\Data Sheets\Passive\FETs\DMP6110SVT.pdf; Value: DMP6110SVT-7; Manufacturer Part Number: DMP6110SVT-7; Supplier 1: Digi-Key; Supplier 1 Part Number: DMP6110SVT-7DICT-ND
Q10 Q11 = 2N7002: MOSFET N-CH 60V 115MA SOT-23; Manufacturer: ON Semiconductor; ComponentLink1Description: Data Sheet; ComponentLink1URL: S:\Hardware\Data Sheets\Active\Transistors\FETs\NDS7002A-D.pdf; Manufacturer Part Number: 2N7002; Value: 2N7002; Supplier 1: Digi-Key; Supplier 1 Part Number: 2N7002NCT-ND
R32-R34 R37-R43 = Res3: Resistor
  R32: Value: 24.9k 1% 125mW
  R33: Value: 68k 1% 100mW
  R34: Value: 12k 1% 100mW
  R37: Value: 2.2k 1% 125mW
  R38-R43: Value: 10k 1% 63mW
R35 = Res Varistor: VARISTOR 8.2V 120A 0805; Manufacturer: Littelfuse Inc; Manufacturer Part Number: V5.5MLA0805H; Value: 5.5V 120A; Supplier 1: Digi-Key; Supplier 1 Part Number: F2215CT-ND
R36 = Res Varistor: VARISTOR 39V 280A 1210; Manufacturer: Littelfuse Inc; Manufacturer Part Number: V30MLA1210NH; Value: 39V 280A; Supplier 1: Digi-Key; Supplier 1 Part Number: F3825CT-ND
U8 = LMR14050: IC REG BUCK ADJUSTABLE 5A 8SOPWR; Manufacturer: Texas Instruments; Value: LMR14050SDDAR; Manufacturer Part Number: LMR14050SDDAR; Supplier 1: Digi-Key; Supplier 1 Part Number: 296-44322-1-ND; ComponentLink1Description: Data Sheet; ComponentLink1URL: S:\Hardware\Data Sheets\Active\Voltage Regulators\lmr14050.pdf
U9 = LP2985AIM5X-6.1/NOPB: IC REG LINEAR 3.3V 500MA SOT23-5; Manufacturer: Texas Instruments; Manufacturer Part Number: TLV75533PDBVR; Value: 3.3V 500mA LDO; Supplier 1: Digi-Key; Supplier 1 Part Number: 296-50411-1-ND
U10 = MIC2005A-1YM5-TR: IC PWR SWITCH P-CHAN 1:1 SOT23-5; Manufacturer: Microchip Technology; Value: P-Channel High Side Switch; Manufacturer Part Number: MIC2005A-1YM5-TR; Supplier 1: Digi-Key; Supplier 1 Part Number: 576-3462-1-ND

## Sheet Loads.SchDoc: DaughterBoard Tester
size Letter; DrawnBy: MTAN; Organization: Altium Limited; DocumentNumber: 6; Revision: A; SheetNumber: 6; SheetTotal: 6
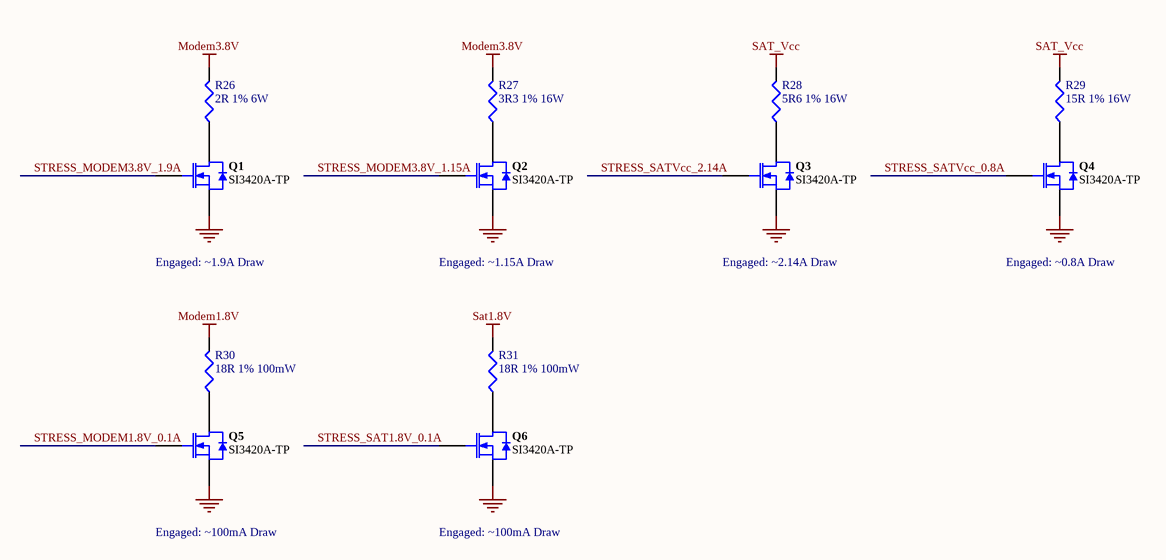
[diagram p5: Loads.SchDoc]

### Parts
Q1  SI3420A-TP  [INF-PG-SOT23_L]
Q2  SI3420A-TP  [INF-PG-SOT23_L]
Q3  SI3420A-TP  [INF-PG-SOT23_L]
Q4  SI3420A-TP  [INF-PG-SOT23_L]
Q5  SI3420A-TP  [INF-PG-SOT23_L]
Q6  SI3420A-TP  [INF-PG-SOT23_L]
R26  2R 1% 6W  [RESC6432AL]
R27  3R3 1% 16W  [RESC6432AL]
R28  5R6 1% 16W  [RESC6432AL]
R29  15R 1% 16W  [RESC6432AL]
R30  18R 1% 100mW  [J1-0603]
R31  18R 1% 100mW  [J1-0603]

### Nets
GND: Q1.2(SOURCE) Q2.2(SOURCE) Q3.2(SOURCE) Q4.2(SOURCE) Q5.2(SOURCE) Q6.2(SOURCE)
Modem1.8V: R30.2
Modem3.8V: R26.2 R27.2
Sat1.8V: R31.2
SAT_Vcc: R28.2 R29.2
STRESS_MODEM1.8V_0.1A: Q5.1(GATE)
STRESS_MODEM3.8V_1.9A: Q1.1(GATE)
STRESS_MODEM3.8V_1.15A: Q2.1(GATE)
STRESS_SAT1.8V_0.1A: Q6.1(GATE)
STRESS_SATVcc_0.8A: Q4.1(GATE)
STRESS_SATVcc_2.14A: Q3.1(GATE)
NetQ1_3: Q1.3(DRAIN) R26.1
NetQ2_3: Q2.3(DRAIN) R27.1
NetQ3_3: Q3.3(DRAIN) R28.1
NetQ4_3: Q4.3(DRAIN) R29.1
NetQ5_3: Q5.3(DRAIN) R30.1
NetQ6_3: Q6.3(DRAIN) R31.1

### Notes on the sheet
- Engaged: ~1.9A Draw
- Engaged: ~1.15A Draw
- Engaged: ~2.14A Draw
- Engaged: ~0.8A Draw
- Engaged: ~100mA Draw
- Title
- Drawn By:
- Date:
- Time:
- Revision:
- Sheet
- of
- The Latium Group of Companies
- 1312 10 Street
- Nisku, Alberta
- T9E 8K2
- Canada
- File:

### Library data of the parts
Q1-Q6 = 2N7002: MOSFET N-CH 20V 6A SOT-23; Manufacturer: Micro Commercial Co; Manufacturer Part Number: SI3420A-TP; Value: SI3420A-TP; Supplier 1: Digi-Key; Supplier 1 Part Number: SI3420A-TPMSCT-ND
R26 = Res3: RES SMD 2 OHM 1% 6W 2512; Manufacturer: Vishay Thin Film; Manufacturer Part Number: PCNM2512K2R00FST5; Value: 2R 1% 6W; Supplier 1: Digi-Key; Supplier 1 Part Number: 764-1271-1-ND
R27 = Res3: RES SMD 3.3 OHM 1% 16W 2512; Manufacturer: Susumu; Manufacturer Part Number: CPA2512Q3R30FS-T10; Value: 3R3 1% 16W; Supplier 1: Digi-Key; Supplier 1 Part Number: CPA25Q3.3CT-ND
R28 = Res3: RES SMD 5.6 OHM 1% 16W 2512; Manufacturer: Susumu; Manufacturer Part Number: CPA2512Q5R60FS-T10; Value: 5R6 1% 16W; Supplier 1: Digi-Key; Supplier 1 Part Number: CPA25Q5.6CT-ND
R29 = Res3: RES SMD 15 OHM 1% 16W 2512; Manufacturer: Susumu; Manufacturer Part Number: CPA2512Q15R0FS-T10; Value: 15R 1% 16W; Supplier 1: Digi-Key; Supplier 1 Part Number: CPA25Q15.0CT-ND
R30 R31 = Res3: Resistor; Value: 18R 1% 100mW

## Nets that join several sheets
3.3V: Concentrator and Modem Headers (R23.2 R24.2), USB (29 pins), Analog (9 pins), Power Supplies (7 pins)
5V: Analog (R11.2), Power Supplies (14 pins)
GND: Concentrator and Modem Headers (102 pins), Expansion Headers (37 pins), USB (36 pins), Analog (26 pins), Power Supplies (27 pins), Loads (6 pins)
Modem1.8V: Concentrator and Modem Headers (J7.10), Analog (U3.11), Loads (R30.2)
Modem3.8V: Concentrator and Modem Headers (10 pins), Analog (R3.2), Loads (R26.2 R27.2)
PVin: Analog (R1.2), Power Supplies (9 pins)
Sat1.8V: Concentrator and Modem Headers (J8.10), Analog (U3.4), Loads (R31.2)
SAT_Vcc: Concentrator and Modem Headers (10 pins), Analog (R4.2), Loads (R28.2 R29.2)
Sw3.3V: Concentrator and Modem Headers (5 pins), Expansion Headers (J9.1 J9.29 J9.30), Analog (R10.2), Power Supplies (U10.5)
Sw5V: Concentrator and Modem Headers (16 pins), Expansion Headers (J10.1 J10.2 J10.3 J10.4), Analog (R12.2), Power Supplies (Q9.1 Q9.2 Q9.5 Q9.6)
SwPVin: Concentrator and Modem Headers (12 pins), Analog (R2.2), Power Supplies (Q8.1 Q8.2 Q8.5 Q8.6)
AD_CHAN1: USB (U12.3), Analog (R17.1)
AD_CHAN2: USB (U12.7), Analog (R19.1)
AD_CHAN3: USB (U12.8), Analog (R18.1)
AD_SELECT0: USB (U14.5), Analog (U3.10 U4.10)
AD_SELECT1: USB (U14.6), Analog (U3.9 U4.9)
~{CELL_1.8V_GOOD}: Concentrator and Modem Headers (J5.15), USB (U13.7)
CELL_PRESENT: Concentrator and Modem Headers (J2.2 R21.2), USB (U13.22)
DIS_5V: USB (U13.23), Power Supplies (Q10.1 R41.1)
DIS_PVin: USB (U13.24), Power Supplies (Q11.1 R43.1)
~{EXP_CS}: Expansion Headers (J10.27), USB (U14.10)
EN_3.3V: USB (R54.1 U14.7), Power Supplies (U10.3)
EXP_PRESENT: Expansion Headers (J9.2 R25.2), USB (U13.27)
EXP_RESET: Expansion Headers (J10.19), USB (U13.25)
EXP_SPI_CLK: Expansion Headers (J10.21), USB (U14.11)
EXP_SPI_MISO: Expansion Headers (J10.25), USB (U14.13)
EXP_SPI_MOSI: Expansion Headers (J10.23), USB (U14.9)
EXP_USB_DM: Expansion Headers (J9.25), USB (U11.8)
EXP_USB_DP: Expansion Headers (J9.26), USB (U11.9)
HOSTRX_EXPTX: Expansion Headers (J10.16), USB (U12.5)
HOSTTX_EXPRX: Expansion Headers (J10.17), USB (U12.6)
LORA_PRESENT: Concentrator and Modem Headers (J1.2 R20.2), USB (U13.21)
~{SAT_1.8V_GOOD}: Concentrator and Modem Headers (J6.8), USB (U13.8)
~{SHORT_SW3.3V}: USB (U14.8), Power Supplies (R38.1 U10.4)
SAT_PRESENT: Concentrator and Modem Headers (J3.2 R22.2), USB (U13.26)
SCLK: Concentrator and Modem Headers (J1.4 J2.4 J3.4 R24.1), Expansion Headers (J9.4), USB (U12.10 U13.12)
SDA: Concentrator and Modem Headers (J1.3 J2.3 J3.3 R23.1), Expansion Headers (J9.3), USB (U12.9 U13.13)
STRESS_MODEM1.8V_0.1A: USB (U13.3), Loads (Q5.1)
STRESS_MODEM3.8V_1.9A: USB (U13.1), Loads (Q1.1)
STRESS_MODEM3.8V_1.15A: USB (U13.2), Loads (Q2.1)
STRESS_SAT1.8V_0.1A: USB (U13.6), Loads (Q6.1)
STRESS_SATVcc_0.8A: USB (U13.5), Loads (Q4.1)
STRESS_SATVcc_2.14A: USB (U13.4), Loads (Q3.1)